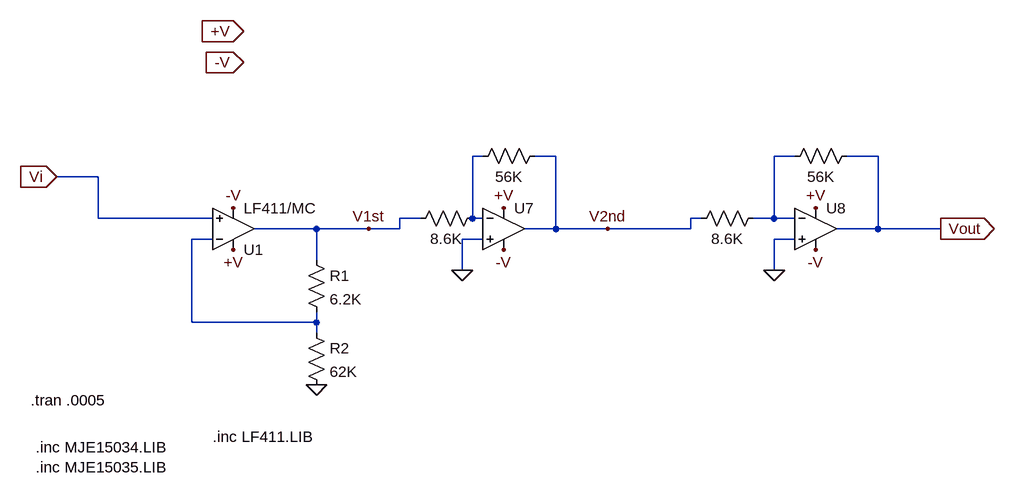
[diagram p0: schematic preamp.asc]
preamp.asc, the LTspice schematic file:
Version 4
SHEET 1 3868 1556
WIRE 864 144 848 144
WIRE 976 144 944 144
WIRE 1344 144 1312 144
WIRE 1472 144 1424 144
WIRE 272 176 208 176
WIRE 272 240 272 176
WIRE 448 240 272 240
WIRE 768 240 736 240
WIRE 848 240 848 144
WIRE 864 240 848 240
WIRE 1200 240 1184 240
WIRE 1312 240 1312 144
WIRE 1312 240 1280 240
WIRE 1344 240 1312 240
WIRE 608 256 512 256
WIRE 688 256 608 256
WIRE 736 256 736 240
WIRE 736 256 688 256
WIRE 976 256 976 144
WIRE 976 256 928 256
WIRE 1056 256 976 256
WIRE 1184 256 1184 240
WIRE 1184 256 1056 256
WIRE 1472 256 1472 144
WIRE 1472 256 1408 256
WIRE 1568 256 1472 256
WIRE 448 272 416 272
WIRE 864 272 832 272
WIRE 1344 272 1312 272
WIRE 608 304 608 256
WIRE 832 320 832 272
WIRE 1312 320 1312 272
WIRE 416 400 416 272
WIRE 608 400 608 384
WIRE 608 400 416 400
WIRE 608 416 608 400
FLAG 208 176 Vi
IOPIN 208 176 In
FLAG 688 256 V1st
FLAG 832 320 0
FLAG 1056 256 V2nd
FLAG 1312 320 0
FLAG 608 496 0
FLAG 480 288 +V
FLAG 480 224 -V
FLAG 896 288 -V
FLAG 1376 288 -V
FLAG 896 224 +V
FLAG 1376 224 +V
FLAG 1568 256 Vout
IOPIN 1568 256 Out
FLAG 496 -48 +V
IOPIN 496 -48 In
FLAG 496 0 -V
IOPIN 496 0 In
SYMBOL res 864 224 R90
WINDOW 0 0 56 Invisible 2
WINDOW 3 32 56 VTop 2
SYMATTR InstName R3
SYMATTR Value 8.6K
SYMATTR SpiceLine tol=5
SYMBOL res 960 128 R90
WINDOW 0 0 56 Invisible 2
WINDOW 3 32 56 VTop 2
SYMATTR InstName R4
SYMATTR Value 56K
SYMATTR SpiceLine tol=5
SYMBOL res 1440 128 R90
WINDOW 0 0 56 Invisible 2
WINDOW 3 32 56 VTop 2
SYMATTR InstName R5
SYMATTR Value 56K
SYMATTR SpiceLine tol=5
SYMBOL res 1296 224 R90
WINDOW 0 0 56 Invisible 2
WINDOW 3 32 56 VTop 2
SYMATTR InstName R6
SYMATTR Value 8.6K
SYMATTR SpiceLine tol=5
SYMBOL Opamps\\UniversalOpamp2 896 256 R0
SYMATTR InstName U7
SYMBOL Opamps\\UniversalOpamp2 1376 256 R0
SYMATTR InstName U8
SYMBOL Opamps\\opamp2 480 320 M180
SYMATTR InstName U1
SYMATTR Value LF411/MC
SYMBOL res 592 288 R0
SYMATTR InstName R1
SYMATTR Value 6.2K
SYMBOL res 592 400 R0
SYMATTR InstName R2
SYMATTR Value 62K
TEXT 168 520 Left 2 !.tran .0005
TEXT 176 592 Left 2 !.inc MJE15034.LIB\n.inc MJE15035.LIB
TEXT 448 576 Left 2 !.inc LF411.LIB

The netlist it stands for:
* preamp.asc
R3 N001 V1st 8.6K tol=5
R4 V2nd N001 56K tol=5
R5 Vout N002 56K tol=5
R6 N002 V2nd 8.6K tol=5
XU7 0 N001 +V -V V2nd level.2 Avol=1Meg GBW=10Meg Slew=10Meg ilimit=25m rail=0 Vos=0 phimargin=45 en=0 enk=0 in=0 ink=0 Rin=500Meg  ; pins IN+ IN- V+ V- OUT
XU8 0 N002 +V -V Vout level.2 Avol=1Meg GBW=10Meg Slew=10Meg ilimit=25m rail=0 Vos=0 phimargin=45 en=0 enk=0 in=0 ink=0 Rin=500Meg  ; pins IN+ IN- V+ V- OUT
XU1 Vi N003 +V -V V1st LF411/MC  ; pins In+ In- V+ V- OUT
R1 V1st N003 6.2K
R2 N003 0 62K
.tran .0005
.inc MJE15034.LIB
.inc MJE15035.LIB
.inc LF411.LIB
.lib UniversalOpamps2.sub
.backanno
.end